# EAGLE board motherboard (EAGLE 9.1.2)
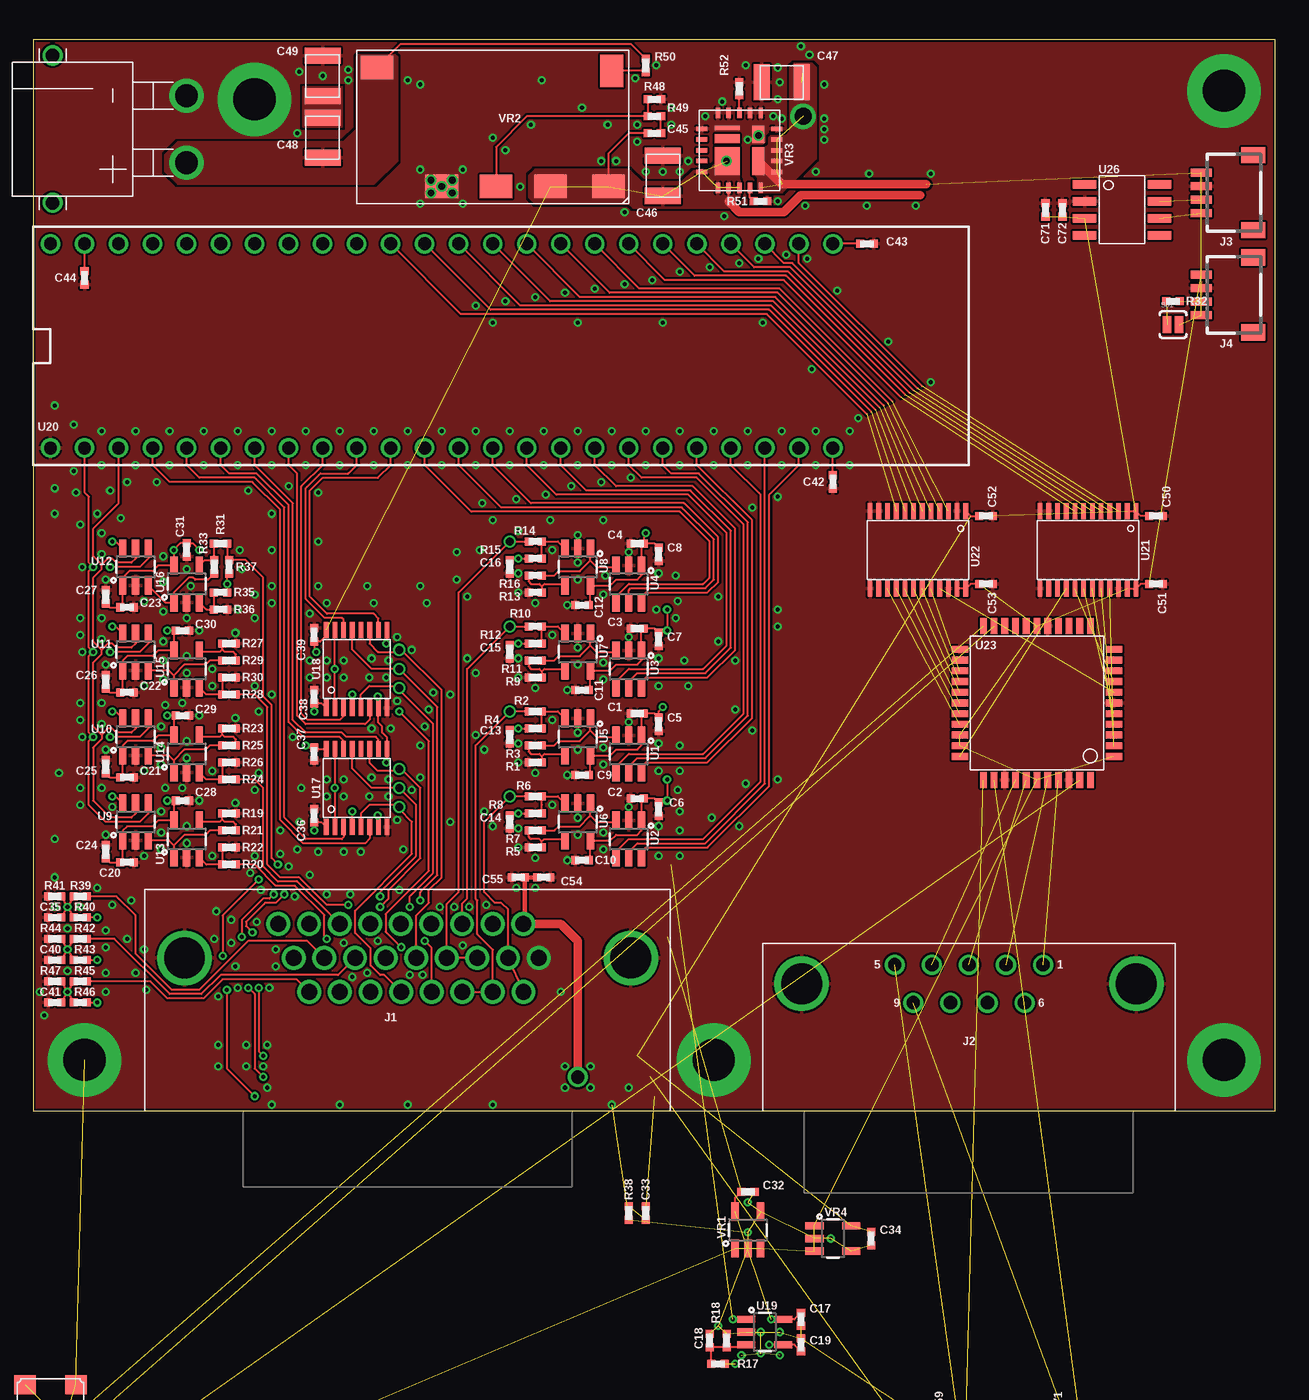
[diagram p5: board, top side]
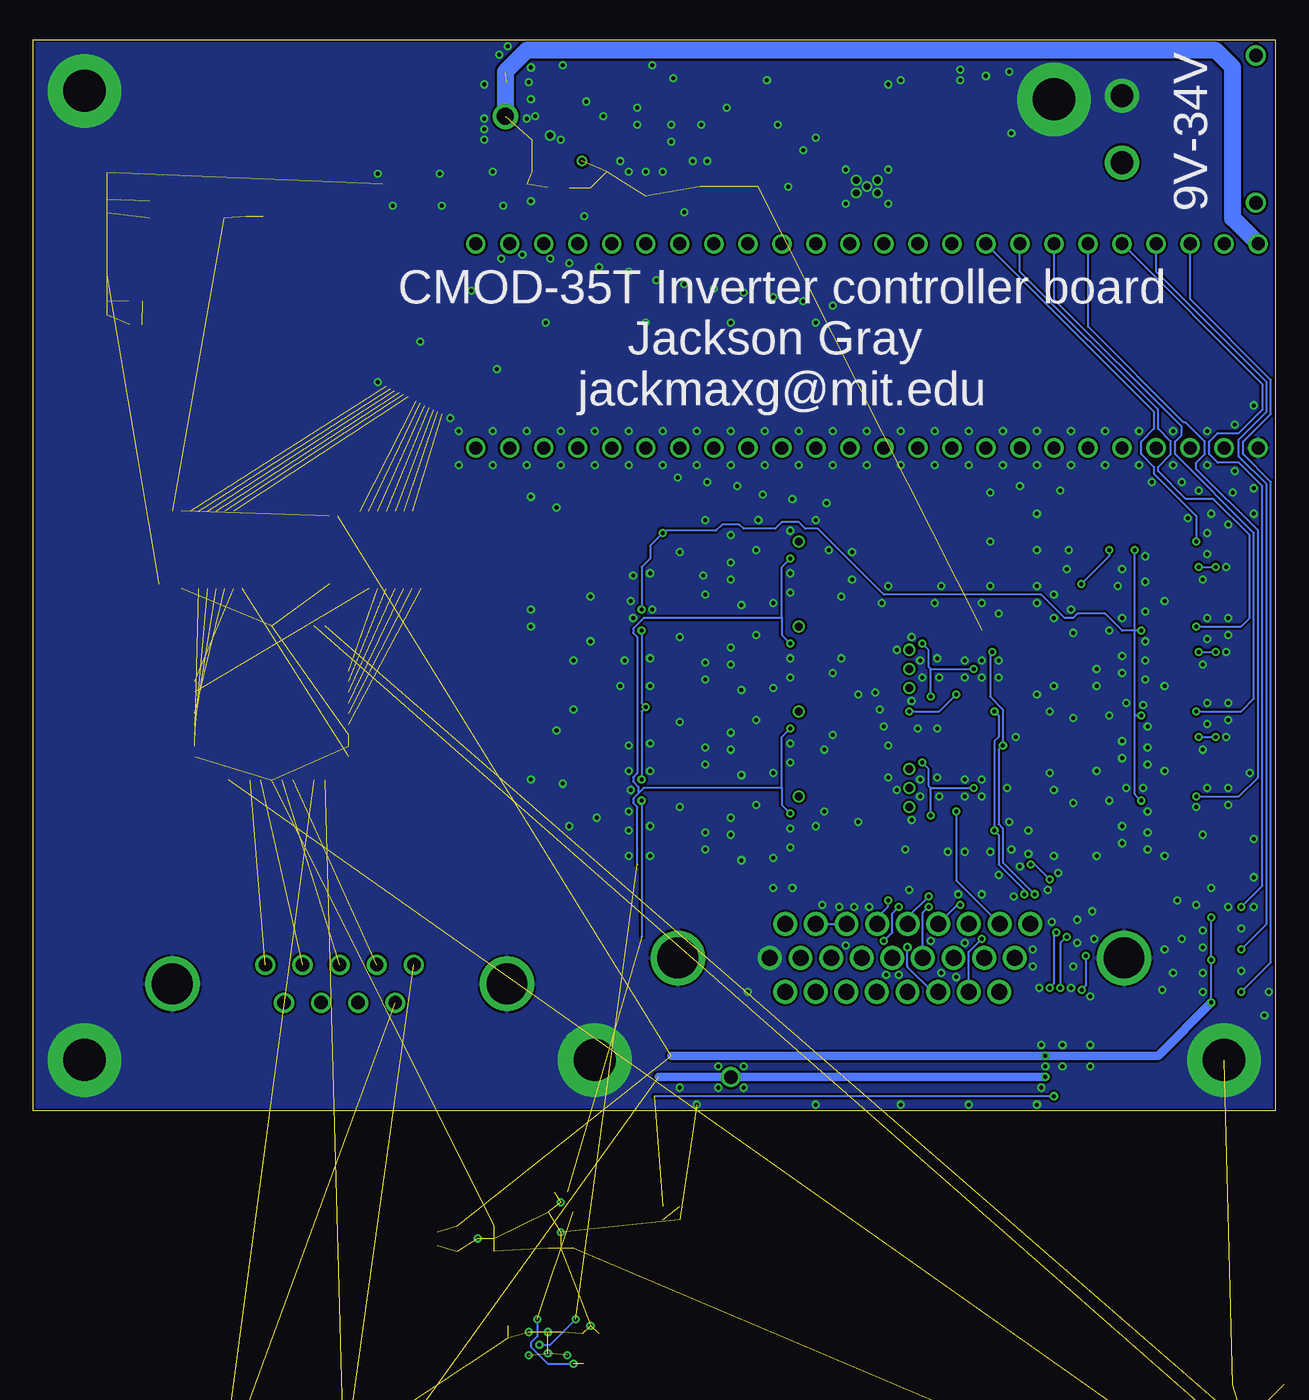
[diagram p6: board, bottom side, seen from below]

Size 92.71 x 80.01 mm. Coordinates in mm from the lower left corner, seen from the top.
Outline: 0,0 92.71,0 92.71,80.01 0,80.01 0,0
Copper layers (1*16): Top 0.035mm / dielectric 1.5mm / Bottom 0.035mm
Design rules "3PCB_2layer": minimum track width 6mil, minimum drill 0.3mm, track to track 6mil, track to pad 6mil, pad to pad 6mil, via to via 6mil, smd to smd 0mil, copper to edge 6mil, drill to drill 6mil, minimum pad ring 6mil, minimum via ring 6mil, stop-mask expansion 2mil, vias tented up to drill 0.3mm, thermal gap 6.25mil

## Footprints (pad centres in the part's own frame; a part is rotated, then mirrored left to right if it is on the bottom)
0402 = smd 0.6 x 0.6: 1 -0.5,0; 2 0.5,0
1210 = smd 1.2 x 2.7: 1 -1.5,0; 2 1.5,0
0603 = smd 1.1 x 1: 1 -0.85,0; 2 0.85,0
M3_HOLE = drill 3.15 pad 5.5: P 0,0
L17HTHA = drill 1.19: 1 8.63,13.97; 2 6.345,13.97; 3 4.06,13.97; 4 1.775,13.97; 5 -0.51,13.97; 6 -2.795,13.97; 7 -5.08,13.97; 8 -7.365,13.97; 9 -9.65,13.97; 10 9.78,11.43; 11 7.495,11.43; 12 5.21,11.43; 13 2.925,11.43; 14 0.64,11.43; 15 -1.645,11.43; 16 -3.93,11.43; 17 -6.215,11.43; 18 -8.5,11.43; 19 8.65,8.89; 20 6.365,8.89; 21 4.08,8.89; 22 1.795,8.89; 23 -0.49,8.89; 24 -2.775,8.89; 25 -5.06,8.89; 26 -7.345,8.89 | drill 3.05: ML -16.66,11.43; MR 16.66,11.43
AE10921 = drill 1: 1 5.54,10.92; 2 2.77,10.92; 3 0,10.92; 4 -2.77,10.92; 5 -5.54,10.92; 6 4.155,8.08; 7 1.385,8.08; 8 -1.385,8.08; 9 -4.155,8.08 | drill 3.05: ML -12.495,9.5; MR 12.495,9.5
SM04B-SRSS-TB = smd 0.6 x 1.55: 1 -1.5,2.975; 2 -0.5,2.975; 3 0.5,2.975; 4 1.5,2.975 | smd 1.2 x 1.8: FIT@1 -2.8,-0.9; FIT@2 2.8,-0.9
SOT23-3 = smd 0.8 x 0.9: 1 -0.95,-1; 2 0.95,-1; 3 0,1.1
0805 = smd 0.927 x 1.2: 1 -0.964,0; 2 0.964,0
SJ_2S-NO = smd 0.635 x 1.27: 1 -0.45,0; 2 0.45,0
1X01_50MIL = drill 0.6: 1 0,0
SOT23-6 = smd 0.55 x 1.35: 1 -0.95,-1.375; 2 0,-1.375; 3 0.95,-1.375; 4 0.95,1.375; 5 0,1.375; 6 -0.95,1.375
SOT23-5 = smd 0.55 x 1.35: 1 -0.95,-1.375; 2 0,-1.375; 3 0.95,-1.375; 4 0.95,1.375; 5 -0.95,1.375
TSSOP-16 = smd 1.2 x 0.35: 1 -2.9,2.275; 2 -2.9,1.625; 3 -2.9,0.975; 4 -2.9,0.325; 5 -2.9,-0.325; 6 -2.9,-0.975; 7 -2.9,-1.625; 8 -2.9,-2.275; 9 2.9,-2.275; 10 2.9,-1.625; 11 2.9,-0.975; 12 2.9,-0.325; 13 2.9,0.325; 14 2.9,0.975; 15 2.9,1.625; 16 2.9,2.275
CMOD_A7_DIP = drill 0.965: 1 -7.62,27.94; 2 -7.62,25.4; 3 -7.62,22.86; 4 -7.62,20.32; 5 -7.62,17.78; 6 -7.62,15.24; 7 -7.62,12.7; 8 -7.62,10.16; 9 -7.62,7.62; 10 -7.62,5.08; 11 -7.62,2.54; 12 -7.62,0; 13 -7.62,-2.54; 14 -7.62,-5.08; 15 -7.62,-7.62; 16 -7.62,-10.16; 17 -7.62,-12.7; 18 -7.62,-15.24; 19 -7.62,-17.78; 20 -7.62,-20.32; 21 -7.62,-22.86; 22 -7.62,-25.4; 23 -7.62,-27.94; 24/VU -7.62,-30.48; 25/GND 7.62,-30.48; 26 7.62,-27.94; 27 7.62,-25.4; 28 7.62,-22.86; 29 7.62,-20.32; 30 7.62,-17.78; 31 7.62,-15.24; 32 7.62,-12.7; 33 7.62,-10.16; 34 7.62,-7.62; 35 7.62,-5.08; 36 7.62,-2.54; 37 7.62,0; 38 7.62,2.54; 39 7.62,5.08; 40 7.62,7.62; 41 7.62,10.16; 42 7.62,12.7; 43 7.62,15.24; 44 7.62,17.78; 45 7.62,20.32; 46 7.62,22.86; 47 7.62,25.4; 48 7.62,27.94
TSSOP-24 = smd 1.2 x 0.35: 1 -2.9,3.575; 2 -2.9,2.925; 3 -2.9,2.275; 4 -2.9,1.625; 5 -2.9,0.975; 6 -2.9,0.325; 7 -2.9,-0.325; 8 -2.9,-0.975; 9 -2.9,-1.625; 10 -2.9,-2.275; 11 -2.9,-2.925; 12 -2.9,-3.575; 13 2.9,-3.575; 14 2.9,-2.925; 15 2.9,-2.275; 16 2.9,-1.625; 17 2.9,-0.975; 18 2.9,-0.325; 19 2.9,0.325; 20 2.9,0.975; 21 2.9,1.625; 22 2.9,2.275; 23 2.9,2.925; 24 2.9,3.575
LQFP44 = smd 1.2 x 0.5: 1 -5.75,4; 2 -5.75,3.2; 3 -5.75,2.4; 4 -5.75,1.6; 5 -5.75,0.8; 6 -5.75,0; 7 -5.75,-0.8; 8 -5.75,-1.6; 9 -5.75,-2.4; 10 -5.75,-3.2; 11 -5.75,-4; 23 5.75,-4; 24 5.75,-3.2; 25 5.75,-2.4; 26 5.75,-1.6; 27 5.75,-0.8; 28 5.75,0; 29 5.75,0.8; 30 5.75,1.6; 31 5.75,2.4; 32 5.75,3.2; 33 5.75,4 | smd 0.5 x 1.2: 12 -4,-5.75; 13 -3.2,-5.75; 14 -2.4,-5.75; 15 -1.6,-5.75; 16 -0.8,-5.75; 17 0,-5.75; 18 0.8,-5.75; 19 1.6,-5.75; 20 2.4,-5.75; 21 3.2,-5.75; 22 4,-5.75; 34 4,5.75; 35 3.2,5.75; 36 2.4,5.75; 37 1.6,5.75; 38 0.8,5.75; 39 0,5.75; 40 -0.8,5.75; 41 -1.6,5.75; 42 -2.4,5.75; 43 -3.2,5.75; 44 -4,5.75
SOIC_8 = smd 1.75 x 0.65: 1 -2.8,1.905; 2 -2.8,0.635; 3 -2.8,-0.635; 4 -2.8,-1.905; 5 2.8,-1.905; 6 2.8,-0.635; 7 2.8,0.635; 8 2.8,1.905
XT30_HORIZONTAL = drill 1.7: + -2.5,0; - 2.5,0 | drill 1: P$3 5.5,10; P$4 -5.5,10
PROLYNX = smd 1.727 x 2.438: 1 1.27,1.524 | smd 2.438 x 1.727: 2 18.796,1.27; 3 13.97,10.16; 4 9.906,10.16; 5 5.842,10.16; 6 1.524,10.16
UPOL_PWR_MODULE = smd 0.8 x 0.33: 1 -2.8,1.6; 2 -2.8,0.8; 3 -2.8,0; 4 -2.8,-0.8; 5 -2.8,-1.6; 11 2.8,-1.6; 12 2.8,-0.8; 13 2.8,0; 14 2.8,0.8; 15 2.8,1.6 | smd 0.33 x 0.8: 6 -1.6,-2.8; 7 -0.8,-2.8; 8 0,-2.8; 9 0.8,-2.8; 10 1.6,-2.8; 16 1.6,2.8; 17 0.8,2.8; 18 0,2.8; 19 -0.8,2.8; 20 -1.6,2.8 | smd 2.1 x 1.88: 21 -0.8,0.91 | smd 0.65 x 1.88: 22 0.865,0.91 | smd 0.36 x 1.88: 23 1.67,0.91 | smd 2.1 x 0.9: 24 -0.8,-1.4 | smd 1.3 x 0.9: 25 1.2,-1.4
5X3.2MM_SMD_XTAL = smd 1.6 x 1.4: 1 -1.9,1.15; 2 1.9,1.15; 3 1.9,-1.15; 4 -1.9,-1.15

## Placement (x,y rotation side)
C1  10n  [0402]  45.09,29.69 180 top
C2  10n  [0402]  45.09,23.34 180 top
C3  10n  [0402]  45.09,36.04 180 top
C4  10n  [0402]  45.09,42.39 180 top
C5  1u  [0402]  46.67,28.89 270 top
C6  1u  [0402]  46.67,22.54 270 top
C7  1u  [0402]  46.67,35.24 270 top
C8  1u  [0402]  46.67,41.59 270 top
C9  10n  [0402]  40.96,25.08 180 top
C10  10n  [0402]  40.96,18.73 180 top
C11  10n  [0402]  40.96,31.43 180 top
C12  10n  [0402]  40.96,37.78 180 top
C13  10n  [0402]  35.56,27.94 270 top
C14  10n  [0402]  35.56,21.59 270 top
C15  10n  [0402]  35.56,34.29 270 top
C16  10n  [0402]  35.56,40.64 270 top
C17  10n  [0402]  57.31,-15.56 270 top  (outside the outline)
C18  10n  [0402]  50.48,-17.14 90 top  (outside the outline)
C19  1u  [0402]  57.31,-17.46 90 top  (outside the outline)
C20  10n  [0402]  6.99,18.57 0 top
C21  10n  [0402]  6.99,24.92 0 top
C22  10n  [0402]  6.99,31.27 0 top
C23  10n  [0402]  6.99,37.62 0 top
C24  1u  [0402]  5.4,19.37 90 top
C25  1u  [0402]  5.4,25.72 90 top
C26  1u  [0402]  5.4,32.07 90 top
C27  1u  [0402]  5.4,38.42 90 top
C28  10n  [0402]  11.11,23.18 0 top
C29  10n  [0402]  11.11,29.53 0 top
C30  10n  [0402]  11.11,35.88 0 top
C31  10n  [0402]  11.43,41.91 270 top
C32  1u  [0402]  53.34,-6.03 0 top  (outside the outline)
C33  10n  [0402]  45.72,-7.62 270 top  (outside the outline)
C34  1u  [0402]  62.55,-9.53 270 top  (outside the outline)
C35  1u  [0402]  1.59,14.45 180 top
C36  1u  [0402]  20.95,22.07 90 top
C37  1u  [0402]  20.95,26.67 270 top
C38  1u  [0402]  20.95,30.96 90 top
C39  1u  [0402]  20.95,35.56 90 top
C40  1u  [0402]  1.59,11.27 180 top
C41  1u  [0402]  1.59,8.1 180 top
C42  1u  [0402]  59.69,46.99 270 top
C43  1u  [0402]  62.23,64.77 0 top
C44  1u  [0402]  3.81,62.23 270 top
C45  220p  [0402]  46.35,73.03 0 top
C46  22u  [1210]  46.99,69.85 90 top
C47  22u  [1210]  55.88,76.83 180 top
C48  22u  [1210]  21.59,72.71 90 top
C49  22u  [1210]  21.59,77.31 90 top
C50  1u  [0402]  83.82,44.45 0 top
C51  1u  [0402]  83.82,39.37 180 top
C52  1u  [0402]  71.12,44.45 0 top
C53  1u  [0402]  71.12,39.37 180 top
C54  1u  [0402]  38.1,17.46 0 top
C55  1u  [0402]  36.2,17.46 180 top
C56  20p  [0402]  2.54,-24.13 0 top  (outside the outline)
C57  20p  [0402]  2.54,-26.67 0 top  (outside the outline)
C58  10u  [0603]  2.54,-29.21 0 top  (outside the outline)
C59  10u  [0603]  2.54,-31.75 0 top  (outside the outline)
C60  10u  [0603]  2.54,-34.29 0 top  (outside the outline)
C61  10u  [0603]  2.54,-36.83 0 top  (outside the outline)
C62  10n  [0402]  2.54,-39.37 0 top  (outside the outline)
C63  10n  [0402]  2.54,-41.91 0 top  (outside the outline)
C64  10n  [0402]  2.54,-44.45 0 top  (outside the outline)
C65  1u  [0402]  70.48,-37.47 270 top  (outside the outline)
C66  1u  [0402]  65.09,-23.5 90 top  (outside the outline)
C67  1u  [0402]  73.98,-23.5 90 top  (outside the outline)
C68  DNP  [0402]  69.06,-26.67 0 top  (outside the outline)
C69  DNP  [0402]  77.95,-26.67 0 top  (outside the outline)
C70  1u  [0402]  79.38,-37.47 270 top  (outside the outline)
C71  1u  [0402]  75.56,67.31 90 top
C72  10n  [0402]  76.83,67.31 90 top
H1  BOLTHOLE_M3  [M3_HOLE]  50.8,3.81 0 top
H2  BOLTHOLE_M3  [M3_HOLE]  16.51,75.56 0 top
H3  BOLTHOLE_M3  [M3_HOLE]  88.9,76.2 0 top
H4  BOLTHOLE_M3  [M3_HOLE]  3.81,3.81 0 top
H5  BOLTHOLE_M3  [M3_HOLE]  88.9,3.81 0 top
J1  PRIUS_INV_DB26  [L17HTHA]  27.94,0 0 top
J2  DB09_RA  [AE10921]  69.85,0 0 top
J3  [SM04B-SRSS-TB]  90.17,68.58 90 top
J4  [SM04B-SRSS-TB]  90.17,60.96 90 top
Q1  [SOT23-3]  69.22,-35.56 270 top  (outside the outline)
Q2  [SOT23-3]  69.22,-30.48 270 top  (outside the outline)
Q3  [SOT23-3]  65.41,-35.56 90 top  (outside the outline)
Q4  [SOT23-3]  65.41,-30.48 90 top  (outside the outline)
Q5  [SOT23-3]  78.11,-35.56 270 top  (outside the outline)
Q6  [SOT23-3]  78.11,-30.48 270 top  (outside the outline)
Q7  [SOT23-3]  74.3,-35.56 90 top  (outside the outline)
Q8  [SOT23-3]  74.3,-30.48 90 top  (outside the outline)
R1  100k  [0402]  37.47,26.04 0 top
R2  100k  [0402]  37.47,29.84 0 top
R3  13.7k  [0402]  37.47,27.3 0 top
R4  13.7k  [0402]  37.47,28.57 180 top
R5  100k  [0402]  37.47,19.68 0 top
R6  100k  [0402]  37.47,23.5 0 top
R7  13.7k  [0402]  37.47,20.95 0 top
R8  13.7k  [0402]  37.47,22.23 180 top
R9  100k  [0402]  37.47,32.38 0 top
R10  100k  [0402]  37.47,36.2 0 top
R11  13.7k  [0402]  37.47,33.66 0 top
R12  13.7k  [0402]  37.47,34.92 180 top
R13  100k  [0402]  37.47,38.73 0 top
R14  100k  [0402]  37.47,42.55 0 top
R15  13.7k  [0402]  37.47,41.27 180 top
R16  13.7k  [0402]  37.47,40.01 0 top
R17  1k  [0402]  51.12,-18.89 180 top  (outside the outline)
R18  1k  [0402]  51.75,-17.14 90 top  (outside the outline)
R19  DNP  [0402]  14.61,22.23 180 top
R20  100k  [0402]  14.61,18.41 180 top
R21  0  [0402]  14.61,20.95 180 top
R22  37.4k  [0402]  14.61,19.68 0 top
R23  DNP  [0402]  14.61,28.57 180 top
R24  100k  [0402]  14.61,24.77 180 top
R25  0  [0402]  14.61,27.3 180 top
R26  37.4k  [0402]  14.61,26.04 0 top
R27  DNP  [0402]  14.61,34.92 180 top
R28  100k  [0402]  14.61,31.11 180 top
R29  0  [0402]  14.61,33.66 180 top
R30  37.4k  [0402]  14.61,32.38 0 top
R31  [0402]  13.97,42.39 0 top
R32  120  [0402]  85.09,60.48 180 top
R33  [0402]  13.49,40.64 270 top
R35  [0402]  13.97,38.73 180 top
R36  10k  [0402]  13.97,37.47 0 top
R37  [0402]  14.61,40.64 90 top
R38  0  [0402]  44.45,-7.62 270 top  (outside the outline)
R39  0  [0402]  3.49,16.03 180 top
R40  1k  [0402]  3.49,14.45 180 top
R41  DNP  [0402]  1.59,16.03 180 top
R42  0  [0402]  3.49,12.86 180 top
R43  1k  [0402]  3.49,11.27 180 top
R44  DNP  [0402]  1.59,12.86 180 top
R45  0  [0402]  3.49,9.68 180 top
R46  1k  [0402]  3.49,8.1 180 top
R47  DNP  [0402]  1.59,9.68 180 top
R48  6.19k  [0402]  46.35,75.56 0 top
R49  330  [0402]  46.35,74.3 180 top
R50  100k  [0402]  45.72,78.11 270 top
R51  13.7k  [0402]  54.29,67.94 0 top
R52  100  [0402]  52.7,76.36 90 top
R53  1k  [0402]  69.06,-25.4 180 top  (outside the outline)
R54  2.4k  [0402]  69.06,-27.94 180 top  (outside the outline)
R55  2.2k  [0402]  70.33,-33.02 90 top  (outside the outline)
R56  3.3  [0402]  68.1,-33.02 90 top  (outside the outline)
R57  3.3  [0402]  66.52,-33.02 270 top  (outside the outline)
R58  2.2k  [0402]  64.29,-33.02 270 top  (outside the outline)
R59  10k  [0402]  67.63,-23.5 270 top  (outside the outline)
R60  4.16k  [0402]  66.36,-23.5 90 top  (outside the outline)
R61  1k  [0402]  77.95,-25.4 180 top  (outside the outline)
R62  2.4k  [0402]  77.95,-27.94 180 top  (outside the outline)
R63  2.2k  [0402]  79.22,-33.02 270 top  (outside the outline)
R64  3.3  [0402]  76.99,-33.02 270 top  (outside the outline)
R65  3.3  [0402]  75.41,-33.02 90 top  (outside the outline)
R66  2.2k  [0402]  73.18,-33.02 90 top  (outside the outline)
R67  4.7k  [0805]  68.42,-38.42 180 top  (outside the outline)
R68  4.7  [0805]  65.09,-38.42 180 top  (outside the outline)
R69  4.7  [0805]  77.31,-38.42 180 top  (outside the outline)
R70  4.7  [0805]  74.14,-38.42 180 top  (outside the outline)
R71  10k  [0402]  76.52,-23.5 270 top  (outside the outline)
R72  4.16k  [0402]  75.25,-23.5 90 top  (outside the outline)
SJ1  [SJ_2S-NO]  85.09,58.74 0 top
TP1  MIV  [1X01_50MIL]  35.56,29.84 0 top
TP2  MIW  [1X01_50MIL]  35.56,23.5 0 top
TP3  GIV  [1X01_50MIL]  35.56,36.2 180 top
TP4  GIW  [1X01_50MIL]  35.56,42.55 180 top
TP5  !MUU  [1X01_50MIL]  27.3,22.7 90 top
TP6  !MVU  [1X01_50MIL]  27.3,25.56 90 top
TP7  !MWU  [1X01_50MIL]  27.3,24.13 90 top
TP8  !GUU  [1X01_50MIL]  27.3,31.59 90 top
TP9  !GVU  [1X01_50MIL]  27.3,34.45 90 top
TP10  !GWU  [1X01_50MIL]  27.3,33.02 90 top
TP11  !EXCOUT  [1X01_50MIL]  79.38,-28.57 180 top  (outside the outline)
TP12  EXCOUT  [1X01_50MIL]  70.48,-28.57 180 top  (outside the outline)
U1  ADS7883  [SOT23-6]  44.45,26.67 180 top
U2  ADS7883  [SOT23-6]  44.45,20.32 180 top
U3  ADS7883  [SOT23-6]  44.45,33.02 180 top
U4  ADS7883  [SOT23-6]  44.45,39.37 180 top
U5  LM7321  [SOT23-5]  40.64,27.94 180 top
U6  LM7321  [SOT23-5]  40.64,21.59 180 top
U7  LM7321  [SOT23-5]  40.64,34.29 180 top
U8  LM7321  [SOT23-5]  40.64,40.64 180 top
U9  ADS7883  [SOT23-6]  7.62,21.59 0 top
U10  ADS7883  [SOT23-6]  7.62,27.94 0 top
U11  ADS7883  [SOT23-6]  7.62,34.29 0 top
U12  ADS7883  [SOT23-6]  7.62,40.64 0 top
U13  LM7321  [SOT23-5]  11.43,20.32 0 top
U14  LM7321  [SOT23-5]  11.43,26.67 0 top
U15  LM7321  [SOT23-5]  11.43,33.02 0 top
U16  LM7321  [SOT23-5]  11.43,39.37 0 top
U17  CD40109BPWR  [TSSOP-16]  24.13,24.13 90 top
U18  CD40109BPWR  [TSSOP-16]  24.13,33.02 90 top
U19  LM7321  [SOT23-5]  54.61,-16.51 270 top  (outside the outline)
U20  CMOD_A7  [CMOD_A7_DIP]  31.75,57.15 270 top
U21  [TSSOP-24]  78.74,41.91 270 top
U22  [TSSOP-24]  66.04,41.91 270 top
U23  ADS1205  [LQFP44]  74.93,30.48 180 top
U24  LM7321  [SOT23-5]  66.04,-26.67 0 top  (outside the outline)
U25  LM7321  [SOT23-5]  74.93,-26.67 0 top  (outside the outline)
U26  SN65HVD23X  [SOIC_8]  81.28,67.31 0 top
U$1  XT30  [XT30_HORIZONTAL]  11.43,73.34 90 top
VR1  [SOT23-5]  53.34,-8.89 0 top  (outside the outline)
VR2  PROLYNX  [PROLYNX]  44.45,79.22 180 top
VR3  MUN24AD03-SM  [UPOL_PWR_MODULE]  52.7,71.75 90 top
VR4  [SOT23-5]  59.69,-9.53 270 top  (outside the outline)
Y1  8.192mHz  [5X3.2MM_SMD_XTAL]  1.27,-21.59 0 top  (outside the outline)

## Tracks (layer width: path | path; a pad name or v marks a point on that pad's centre or on a via)
3.3V  (via drill 0.3)  (7 unrouted)
  Top 0.159: R46.1 v4.76,8.1 | v4.76,14.45 R40.1 | R43.1 v4.76,11.27 | U21.2 U21.1 82.67,44.45 C50.1 | U22.1 69.97,44.45 C52.1 | v20.95,29.84 C38.1 21.52,30.46 U18.1 | v20.95,20.95 C36.1 21.52,21.57 U17.1 | v18.73,16.19 18.1,15.56 17.3,15.56 15.88,14.13 15.88,13.81 v16.35,13.34 | v16.83,9.21 16.83,4.45 v17.14,4.13
  Bottom 0.159: v4.76,8.1 v4.76,11.27 v4.76,14.45 | v20.95,29.84 20.64,29.53 20.64,27.94 20.95,27.62 v20.95,20.95 20.64,20.64 20.64,18.41 18.73,16.51 v18.73,16.19 | v16.83,9.21 16.51,9.53 16.51,13.18 v16.35,13.34
  Bottom 0.635: v4.76,8.1 8.73,4.13 v17.14,4.13 45.09,4.13
5V  (via drill 1.27)  (26 unrouted)
  Top 0.159: C51.2 82.67,39.37 U21.24 U21.23 | C53.2 69.97,39.37 U22.24 U22.23
  Top 0.635: 66.67,69.22 55.88,69.22 VR3.24
  Bottom 1.27: U20.24/VU 3.17,66.67 3.17,77.95 4.45,79.22 55.88,79.22 57.47,77.63 v57.47,74.3
  pour Top (no thermals): 53.82,71.91 54.61,71.91 54.93,72.23 54.93,72.71 55.09,72.87 56.2,72.87 56.52,73.18 56.52,77.95 56.83,78.26 58.1,78.26 58.42,77.95 58.42,71.12 55.88,68.58 54.29,68.58 54.13,68.74 54.13,69.69 53.82,70.01
12V  (via drill 0.3, 0.5, 1)  (21 unrouted)
  Top 0.159: U17.16 21.09,27.03 C37.1 20.45,27.17 v20.32,27.3 | C45.1 44.45,73.03 42.93,71.5 VR2.6 | 51.91,67.94 51.91,67.95 VR3.2 | v21.11,34.29 20.95,34.45 C39.1 21.41,35.06 21.86,35.51 U18.16 | v15.56,13.02 15.56,14.29 17.14,15.88 17.62,15.88 v17.94,16.19 | v16.03,9.21 16.51,8.73 16.51,3.17 v17.14,2.54
  Top 0.318: C54.1 C55.1 36.7,14.1 J1.1
  Top 0.635: 66.2,68.42 57.31,68.42 56.04,67.15 52.7,67.15 51.91,67.94 | J1.1 39.37,13.97 40.64,12.7 v40.64,2.54
  Bottom 0.159: v21.11,34.29 21.27,34.13 21.27,30.96 20.32,30 v20.32,27.3 20.64,26.99 20.64,21.43 20.32,21.11 20.32,18.57 v17.94,16.19 | v15.56,13.02 16.03,12.54 v16.03,9.21
  Bottom 0.635: 46.04,2.54 v40.64,2.54 v17.14,2.54
  other vias: 51.75,70.96
  pour Top: 46.99,69.37 45.4,69.37 44.45,70.33 37.47,70.33 36.99,69.85 36.99,68.9 36.99,68.26 37.47,67.79 44.45,67.79 44.77,67.47 47.94,67.47 51.91,67.47 52.86,68.42 52.86,69.37 52.7,69.53 52.7,71.6 52.39,71.91 51.12,71.91 50.96,71.75 50.96,70.8 50.48,70.33 49.37,70.33 48.42,69.37
!ADC_GIV_CS
  Top 0.159: U3.6 45.4,32.06 45.72,32.38 50.32,32.38 52.39,34.45 52.39,43.5 49.21,46.67 43.5,46.67 41.91,48.26 U20.41
!ADC_GIVT_CS  (via drill 0.3)
  Top 0.159: U11.6 6.14,36.2 v5.87,36.2
  Bottom 0.159: v5.87,36.2 2.54,36.2 1.91,36.83 1.91,43.02 4.6,45.72 6.67,45.72 8.73,47.78 8.73,48.1 7.78,49.05 7.78,50.01 8.73,50.96 8.73,52.39 19.05,62.71 U20.17
!ADC_GIW_CS
  Top 0.159: U4.6 45.4,38.41 45.72,38.73 50.32,38.73 51.12,39.53 51.12,42.86 48.58,45.4 37.15,45.4 34.29,48.26 U20.38
!ADC_MIV_CS
  Top 0.159: U1.6 45.4,25.71 45.72,26.04 50.32,26.04 53.66,29.37 53.66,44.13 49.53,48.26 U20.44
!ADC_MIVT_CS  (via drill 0.3)
  Top 0.159: U10.6 6.14,29.84 v5.87,29.84
  Bottom 0.159: v5.87,29.84 2.54,29.84 1.59,30.8 1.59,43.18 7.46,49.05 7.46,50.01 6.99,50.48 6.99,51.12 16.51,60.64 U20.18
!ADC_MIW_CS
  Top 0.159: U2.6 45.4,19.36 45.72,19.68 50.32,19.68 54.93,24.29 54.93,46.04 57.15,48.26 U20.47
!ADC_MTEMP_CS  (via drill 0.3)
  Top 0.159: U12.6 6.14,42.55 v5.87,42.55
  Bottom 0.159: v5.87,42.55 5.87,44.45 9.05,47.62 9.05,48.1 10,49.05 10,50.01 9.05,50.96 9.05,52.23 U20.16
!ADC_VH_CS  (via drill 0.3)
  Top 0.159: U9.6 6.14,23.5 v5.87,23.5
  Bottom 0.159: v5.87,23.5 2.7,23.5 1.27,24.92 1.27,43.34 5.87,47.94 5.87,48.42 5.24,49.05 5.24,50.01 6.67,51.44 6.83,51.44 13.97,58.58 U20.19
!GSDN  (via drill 0.3)
  Top 0.159: v27.45,12.24 26.3,13.39 26.3,14.71 29.53,17.94 29.53,27.62 v27.3,29.84 | v23.81,31.11 v23.8,31.11 U18.4
  Bottom 0.159: J1.24 25.56,8.89 27.45,10.78 v27.45,12.24 | v27.3,29.84 25.08,29.84 v23.81,31.11
!GSDN_LV
  Top 0.159: U18.3 23.16,29.5 22.86,29.21 20.48,29.21 20,29.69 20,46.67 21.59,48.26 U20.33
!GUU  (via drill 0.3)
  Top 0.159: J1.22 29.73,12.18 v29.21,12.7 | v28.1,15.24 28.1,16.03 29.84,17.78 29.84,28.89 27.3,31.43 TP8.1 27.15,31.75 25.08,31.75 24.45,31.12 U18.5
  Bottom 0.159: v29.21,12.7 28.57,13.34 28.57,14.76 v28.1,15.24
!GUU_LV
  Top 0.159: U18.6 25.11,29.23 24.77,28.89 20.32,28.89 19.68,29.53 19.68,47.62 19.05,48.26 U20.32
!GVU
  Top 0.159: J1.14 28.58,14.6 29.53,15.55 29.53,16.51 30.48,17.46 30.48,31.43 27.46,34.45 TP9.1 27.15,34.29 25.72,34.29 25.11,34.9 U18.11
!GVU_LV
  Top 0.159: U18.10 25.75,36.79 25.4,37.15 21.91,37.15 20.64,38.42 20.64,46.35 21.59,47.31 25.72,47.31 26.67,48.26 U20.35
!GWU  (via drill 0.3)
  Top 0.159: v28.89,15.72 28.89,16.35 30.16,17.62 30.16,30.16 TP10.1 25.24,33.02 23.8,34.46 U18.13
  Bottom 0.159: v28.89,15.72 28.89,15.27 29.71,14.45 J1.4
!GWU_LV
  Top 0.159: U18.14 23.16,36.69 23.02,36.83 21.75,36.83 20.32,38.26 20.32,46.51 21.43,47.62 23.5,47.62 24.13,48.26 U20.34
!MSDN  (via drill 0.3)
  Top 0.159: U17.4 v23.8,22.38 v23.81,22.38
  Bottom 0.159: v23.81,22.38 23.81,17.21 J1.8
!MSDN_LV
  Top 0.159: U17.3 23.16,20.46 23.02,20.32 20.32,20.32 18.73,21.91 18.73,45.09 16.51,47.31 12.38,47.31 11.43,48.26 U20.29
!MUU
  Top 0.159: J1.23 26.18,10.16 25.88,10.16 25.16,10.87 25.16,12.14 24.01,13.3 24.01,14.96 28.26,19.21 28.26,21.59 27.3,22.54 TP5.1 27.15,22.86 25.08,22.86 24.45,22.23 U17.5
!MUU_LV
  Top 0.159: U17.6 25.11,20.34 24.77,20 20.16,20 18.41,21.75 18.41,44.93 16.35,46.99 10.16,46.99 8.89,48.26 U20.28
!MVU  (via drill 0.3)
  Top 0.159: v25.88,15.24 26.51,15.88 26.51,16.51 28.89,18.89 28.89,24.13 27.46,25.56 TP6.1 27.15,25.4 25.72,25.4 25.11,26.01 U17.11
  Bottom 0.159: J1.15 26.3,14.82 v25.88,15.24
!MVU_LV
  Top 0.159: U17.10 25.75,27.74 25.56,27.94 23.34,27.94 23.02,28.26 20.32,28.26 19.37,29.21 19.37,45.4 16.51,48.26 U20.31
!MWU  (via drill 0.3)
  Top 0.159: v25.88,16.03 25.88,16.35 28.57,19.05 28.57,22.86 TP7.1 25.24,24.13 23.8,25.57 U17.13
  Bottom 0.159: J1.5 27.43,14.48 v25.88,16.03
!MWU_LV
  Top 0.159: U17.14 23.16,27.64 22.86,27.94 20.16,27.94 19.05,29.05 19.05,45.24 16.67,47.62 14.61,47.62 13.97,48.26 U20.30
!RD_CS  (1 unrouted)
!RD_CS_LV  (1 unrouted)
  Top 0.159: 66.04,53.98 56.67,63.34 56.04,63.34 U20.3
!RD_DOS  (1 unrouted)
!RD_DOS_LV  (1 unrouted)
  Top 0.159: 62.55,52.23 54.93,59.85 34.13,59.85 U20.13
!RD_EXC  (1 unrouted)
!RD_EXCOUT  (5 unrouted)
!RD_LOT  (1 unrouted)
!RD_LOT_LV  (1 unrouted)
  Top 0.159: 62.23,52.07 54.77,59.53 31.91,59.53 U20.14
!RD_RD  (1 unrouted)
!RD_RD_LV  (1 unrouted)
  Top 0.159: 66.36,54.13 57.15,63.34 U20.2
!RD_RDVEL  (1 unrouted)
!RD_RDVEL_LV  (1 unrouted)
  Top 0.159: 65.41,53.66 56.36,62.71 51.59,62.71 U20.5
!RD_RESET  (1 unrouted)
!RD_RESET_LV  (1 unrouted)
  Top 0.159: 64.77,53.34 56.04,62.07 47.15,62.07 U20.7
!RD_SAMPLE  (1 unrouted)
!RD_SAMPLE_LV  (1 unrouted)
  Top 0.159: 65.72,53.82 56.52,63.02 53.82,63.02 U20.4
ADC_GIV_SCLK
  Top 0.159: U3.4 43.5,32.07 44.45,33.02 50.01,33.02 51.75,34.77 51.75,43.18 48.9,46.04 39.05,46.04 36.83,48.26 U20.39
ADC_GIV_SDO
  Top 0.159: U3.5 44.45,32.07 45.09,32.7 50.16,32.7 52.07,34.61 52.07,43.34 49.05,46.35 41.27,46.35 39.37,48.26 U20.40
ADC_GIW_SCLK
  Top 0.159: U4.4 43.5,38.42 44.45,39.37 50.01,39.37 50.48,39.85 50.48,41.91 50.48,42.55 48.26,44.77 32.7,44.77 29.21,48.26 U20.36
ADC_GIW_SDO
  Top 0.159: U4.5 44.45,38.89 44.61,39.05 50.16,39.05 50.8,39.69 50.8,42.7 48.42,45.09 34.92,45.09 31.75,48.26 U20.37
ADC_HALFV  (via drill 0.3)  (1 unrouted)
  Top 0.159: C14.1 35.7,22.23 v36.2,22.23 R8.2 | C13.1 35.7,28.57 v36.2,28.57 R4.2 | C15.1 35.7,34.92 v36.2,34.92 R12.2 | C16.1 35.7,41.27 v36.2,41.27 R15.2 | C19.1 56.81,-17.46 U19.4 v54.93,-17.46 | v52.23,-15.56 U19.1
  Bottom 0.159: 36.83,36.83 36.83,40.64 v36.2,41.27 | 36.83,36.83 36.83,35.56 v36.2,34.92 | 36.83,24.13 36.83,27.94 v36.2,28.57 | 36.83,24.13 36.83,22.86 v36.2,22.23 | 47.55,23.73 47.15,24.13 36.83,24.13 | 47.55,23.73 47.94,23.34 47.94,23.02 47.62,22.7 47.62,18.41 | 36.83,36.83 47.15,36.83 47.94,36.04 47.94,35.72 47.62,35.4 47.62,25.24 47.94,24.92 47.94,24.61 47.55,24.21 47.55,23.73 | v54.93,-17.46 54.13,-17.46 v52.23,-15.56
ADC_HALFV_REF
  Top 0.159: U19.3 53.05,-17.64 R18.1 C18.1 50.62,-17.78 R17.2
ADC_LFREQ_SCLK  (via drill 0.3)
  Top 0.159: U9.4 8.57,22.22 7.94,21.59 5.4,21.59 4.13,22.86 4.13,27.62 v4.45,27.94 4.13,28.26 4.13,33.97 v4.45,34.29 4.13,34.61 4.13,40.32 v4.45,40.64 4.13,40.96 4.13,45.88 3.81,46.2 U20.26 | U10.4 8.57,28.57 7.94,27.94 v5.71,27.94 | U11.4 8.57,34.92 7.94,34.29 v5.71,34.29 | U12.4 8.57,41.27 7.94,40.64 v5.71,40.64
  Bottom 0.159: v5.71,40.64 v4.45,40.64 | v5.71,34.29 v4.45,34.29 | v5.71,27.94 v4.45,27.94
ADC_LFREQ_SDO
  Top 0.159: U9.5 7.62,22.23 7.3,21.91 5.71,21.91 4.45,23.18 4.45,27.15 5.08,27.78 5.08,28.1 | U10.5 7.62,28.57 7.3,28.26 6.19,28.26 5.87,28.57 5.56,28.57 5.08,28.1 | U11.5 7.62,34.92 7.3,34.61 6.19,34.61 5.87,34.92 5.56,34.92 5.08,34.45 | U12.5 7.62,41.27 7.3,40.96 6.19,40.96 5.87,41.27 5.56,41.27 5.08,40.8 | 5.08,28.1 4.45,28.73 4.45,33.5 5.08,34.13 5.08,34.45 | 5.08,34.45 4.45,35.08 4.45,39.85 5.08,40.48 5.08,40.8 | 5.08,40.8 4.45,41.43 4.45,43.5 6.35,45.4 U20.27
ADC_MIV_SCLK
  Top 0.159: U1.4 43.5,25.72 44.45,26.67 50.01,26.67 53.02,29.69 53.02,43.81 49.53,47.31 45.4,47.31 44.45,48.26 U20.42
ADC_MIV_SDO
  Top 0.159: U1.5 44.45,25.72 45.09,26.35 50.16,26.35 53.34,29.53 53.34,43.97 49.69,47.62 47.62,47.62 46.99,48.26 U20.43
ADC_MIW_SCLK
  Top 0.159: U2.4 43.5,19.37 44.45,20.32 50.01,20.32 54.29,24.61 54.29,46.04 52.07,48.26 U20.45
ADC_MIW_SDO
  Top 0.159: U2.5 44.45,19.37 45.09,20 50.16,20 54.61,24.45 U20.46
ADC_VDD  (via drill 0.3)  (3 unrouted)
  Top 0.159: C4.1 45.4,42.2 U4.1 45.4,40 45.09,39.69 43.5,39.69 43.08,39.27 U8.5 41.59,37.91 C12.1 | C8.1 46.38,42.39 C4.1 | C10.1 41.59,18.86 U6.5 43.08,20.21 43.5,20.64 45.09,20.64 45.4,20.95 U2.1 45.4,23.15 C2.1 46.38,23.34 C6.1 46.81,23.18 v47.31,23.18 v47.31,24.77 | C9.1 41.59,25.21 U5.5 43.08,26.57 43.5,26.99 45.09,26.99 45.4,27.3 U1.1 45.4,29.5 C1.1 46.38,29.69 C5.1 46.67,29.84 v46.99,30.16 | C11.1 41.59,31.57 U7.5 43.08,32.91 43.5,33.34 45.09,33.34 45.4,33.65 U3.1 45.4,35.85 C3.1 46.38,36.04 C7.1 46.81,35.88 v47.31,35.88 v47.31,37.47 | C24.1 5.69,18.57 C20.1 6.67,18.76 U9.1 6.67,20.95 6.99,21.27 8.89,21.27 9.31,21.7 U13.5 10.48,23.05 C28.1 v10,23.18 | C25.1 5.69,24.92 C21.1 6.67,25.11 U10.1 6.67,27.3 6.99,27.62 8.89,27.62 9.31,28.05 U14.5 10.48,29.39 C29.1 v10,29.53 | C26.1 5.69,31.27 C22.1 6.67,31.46 U11.1 6.67,33.66 6.99,33.97 8.89,33.97 9.31,34.4 U15.5 10.48,35.74 C30.1 v10,35.88 | C27.1 5.69,37.62 C23.1 6.67,37.81 U12.1 6.83,39.42 6.83,40.01 7.14,40.32 8.89,40.32 9.31,40.74 U16.5 v10.48,41.91 10.98,42.41 C31.1 11.88,42.41 v12.38,41.91 | R35.1 v14.47,39.37 14.47,40.01 R37.1 | v45.72,43.18 45.59,43.05 C4.1 | VR1.5 52.39,-6.48 C32.1 | C17.1 56.81,-15.56 U19.5 v55.09,-15.56
  Bottom 0.159: v12.38,41.91 12.38,41.46 v14.47,39.37 | v10,23.18 10.48,23.65 10.48,29.53 | 10.48,29.53 10.48,35.88 | 10.48,35.88 v10.48,41.91 | v10,29.53 10.48,29.53 | v10,35.88 10.48,35.88 | 10.48,35.88 11.43,35.88 12.7,37.15 14.76,37.15 15.08,36.83 15.72,36.83 17.46,38.58 29.21,38.58 34.13,43.5 35.08,43.5 35.56,43.97 36.83,43.97 37.31,43.5 39.69,43.5 40.01,43.81 41.27,43.81 41.75,43.34 45.56,43.34 v45.72,43.18 46.67,42.23 46.67,41.27 47.31,40.64 v47.31,37.47 | v47.31,35.88 47.31,30.48 v46.99,30.16 47.31,29.84 v47.31,24.77 | v47.31,23.18 47.31,13.02 | v55.09,-15.56 55.09,-16.83 55.56,-17.3 55.56,-17.62 54.29,-18.89 v52.39,-18.89
CANH  (3 unrouted)
CANL  (3 unrouted)
DIGITALOUT_HIGHZ  (via drill 0.3)
  Top 0.159: U17.15 v22.5,24.13 U17.2 | U17.7 25.75,22.03 v25.72,22.07 | v26.35,26.04 26.41,26.09 U17.9 26.41,27.89 26.04,28.26 26.04,28.73 25.75,29.01 U18.7 25.75,30.92 v25.72,30.96 | v26.35,34.92 26.41,34.98 U18.9 | U18.2 v22.5,33.02 U18.15
  Bottom 0.159: v25.72,22.07 25.72,24.13 | 25.72,24.13 25.88,24.29 25.88,25.56 v26.35,26.04 | 25.72,24.13 v22.5,24.13 | v25.72,30.96 25.72,33.02 | 25.72,33.02 25.88,33.18 25.88,34.45 v26.35,34.92 | 25.72,33.02 v22.5,33.02
GFIV
  Top 0.159: J1.16 22.74,10.16 13.97,10.16 12.54,8.73 10.16,8.73 6.03,12.86 R42.1
GFIV_LV  (via drill 0.3)
  Top 0.159: R42.2 2.67,12.29 v2.54,12.06 | v2.54,12.06 C40.1 | R44.1 v2.54,12.06 | v2.54,12.06 R43.2
  Bottom 0.159: v2.54,12.06 0.64,13.97 0.64,46.83 2.7,48.9 2.7,50.16 0.64,52.23 0.64,54.45 8.89,62.71 U20.21
GIV
  Top 0.159: J1.3 32,15.49 32.38,15.88 32.38,33.02 TP3.1 R10.1
  Bottom 0.159: J1.2 J1.3
GIVT  (via drill 0.3)
  Top 0.159: v23.5,15.4 21.91,15.4 19.84,17.46 18.41,17.46 17.46,18.41 17.46,30.16 16.51,31.11 R28.1
  Bottom 0.159: J1.6 23.72,15.4 v23.5,15.4
GIW
  Top 0.159: J1.12 J1.13 30.86,15.47 31.75,16.35 31.75,38.73 TP4.1 R14.1
GND  (via drill 0.3, 0.5)  (44 unrouted)
  other vias: 39.37,8.89 32.07,12.38 31.43,15.24 33.81,15.4 32.54,15.24 30.32,15.24 27.3,16.51 26.51,23.5 26.51,24.77 40.64,21.91 40.64,28.26 40.64,34.61 40.64,40.96 44.45,35.4 44.45,41.75 44.45,29.05 44.45,22.7 40.64,20.64 40.64,26.99 40.64,33.34 40.64,39.69 36.2,33.81 36.2,27.46 36.2,21.11 36.2,40.16 46.67,21.27 46.67,27.46 46.67,33.81 46.67,40.16 38.73,22.86 38.73,29.21 38.73,35.56 38.73,41.91 25.24,28.57 25.08,32.38 26.35,32.38 25.08,23.5 25.24,24.92 25.24,33.81 26.51,33.66 23.18,32.38 23.18,33.66 21.91,33.66 21.91,32.38 21.91,24.77 23.18,24.77 23.18,23.5 21.91,23.5 29.53,30 29.84,31.27 29.21,28.73 28.26,23.97 27.15,21.75 27.15,30.64 39.85,25.08 39.85,18.73 39.85,31.43 39.85,37.78 48.1,38.1 42.7,40.01 42.55,38.58 42.55,33.5 42.55,32.23 42.55,27.15 42.55,25.88 42.55,19.53 42.55,20.8 33.66,22.38 33.02,28.1 32.38,33.81 36.2,38.73 37.47,37.94 36.2,32.38 37.47,31.59 37.47,25.24 36.2,26.04 37.47,18.89 36.2,19.68 34.29,21.27 33.66,26.99 33.02,32.7 32.38,38.42 31.59,39.69 31.11,31.11 31.11,21.59 53.66,28.42 52.39,33.66 51.12,38.42 51.12,35.08 55.56,36.2 55.56,37.47 52.39,30 53.18,24.45 50.64,21.91 55.56,24.77 52.7,21.27 23.18,12.54 25.72,12.7 18.1,12.06 15.08,10.79 27.94,76.99 21.59,77.31 28.89,76.68 23.5,76.99 19.68,73.03 19.84,77.63 23.5,77.79 28.89,67.79 32.07,67.79 32.07,70.33 28.89,70.33 29.69,69.53 31.27,69.53 29.69,68.58 31.27,68.58 30.48,69.06 51.59,66.83 55.56,67.94 54.13,72.87 46.99,70.17 45.72,70.17 48.26,70.17 35.24,71.75 37.15,73.66 34.29,72.71 40.96,74.93 42.86,73.66 43.5,70.96 42.39,70.96 45.09,73.66 47.62,73.66 47.62,74.93 37.94,76.99 44.93,77.15 46.51,78.11 50.16,74.3 55.24,74.3 55.56,77.95 59.05,76.68 55.72,76.83 53.18,78.11 55.88,74.14 59.05,73.34 59.05,74.14 59.05,72.55 53.34,72.55 55.56,75.56 51.44,75.41 48.9,70.96 44.13,67.15 45.09,72.39 36.35,69.06 57.94,78.9 57.31,79.53 26.67,28.57 8.26,12.06 7.62,10.32 8.41,9.05 1.59,20.32 5.4,10.32 5.4,12.22 5.4,13.49 6.99,12.86 5.4,8.89 5.87,15.4 7.3,15.72 3.49,15.24 1.59,15.24 2.54,13.65 1.59,17.46 4.76,16.67 0.79,7.14 2.54,10.48 0.48,8.89 1.59,46.51 1.59,52.7 3.02,51.28 3.02,47.78 7.62,48.26 7.62,50.8 5.08,50.8 5.08,48.26 10.16,50.8 12.7,50.8 15.24,50.8 17.78,50.8 17.78,48.26 15.24,48.26 12.7,48.26 10.16,48.26 20.32,50.8 22.86,50.8 25.4,50.8 27.94,50.8 20.32,48.26 22.86,48.26 25.4,48.26 27.94,48.26 30.48,48.26 30.48,50.8 33.02,50.8 35.56,50.8 33.02,48.26 35.56,48.26 38.1,48.26 38.1,50.8 40.64,48.26 40.64,50.8 43.18,50.8 45.72,50.8 43.18,48.26 45.72,48.26 48.26,48.26 48.26,50.8 50.8,50.8 50.8,48.26 53.34,48.26 53.34,50.8 55.88,50.8 58.42,50.8 60.96,50.8 60.96,48.26 58.42,48.26 55.88,48.26 1.91,25.24 12.38,29.53 12.38,23.18 12.38,35.88 11.43,26.35 11.43,27.62 11.43,32.7 11.43,33.97 11.43,21.27 11.43,20 9.53,27.15 9.53,25.88 9.53,28.73 8.26,25.4 5.4,26.99 8.26,19.05 9.53,19.53 9.53,20.8 9.53,22.38 5.4,20.64 13.34,19.05 13.34,25.4 13.34,31.75 15.08,29.37 15.08,35.72 15.08,23.02 5.4,33.34 8.26,31.75 11.43,40.48 11.75,39.21 9.68,39.53 8.26,38.1 5.4,39.69 15.24,37.47 11.43,36.83 57.63,67.63 58.42,70.17 65.88,67.63 66.99,70.01 62.39,70.01 62.23,67.63 44.45,1.75 34.29,0.48 27.94,0.48 22.86,0.48 17.78,0.48 43.18,0.48 59.53,-9.53 39.69,1.75 17.78,31.11 18.41,20.95 28.89,24.92 28.89,27.3 19.37,27.94 20.64,33.66 20.64,32.38 15.24,9.21 24.92,10.32 23.81,10 29.05,10.16 28.1,10.16 14.76,12.54 19.05,18.26 19.53,16.03 16.67,14.13 18.1,10.79 21.91,16.19 23.65,16.19 20.64,17.62 23.18,19.37 21.27,19.37 19.68,19.53 19.84,21.59 27.62,19.53 24.45,19.37 16.99,16.51 14.76,14.29 13.65,14.92 16.19,17.78 16.51,19.05 18.41,19.21 16.51,23.97 16.83,25.24 16.83,29.84 16.51,31.75 15.56,40.48 15.4,41.91 20,24.13 17.46,1.75 17.14,3.33 15.88,3.33 15.88,4.92 17.46,4.92 13.81,4.92 13.81,3.33 13.81,8.57 17.62,9.21 13.49,12.86 39.69,3.33 41.59,3.33 41.59,1.75 20.64,37.15 21.91,37.94 27.15,35.4 28.26,34.45 9.68,41.43 9.68,37.31 9.68,35.08 9.68,32.23 9.68,33.66 13.34,33.02 9.84,24.13 11.11,24.13 9.84,30.32 11.11,30.48 5.08,35.24 5.08,41.59 5.87,22.7 5.08,28.89 3.65,34.29 3.65,27.94 3.65,40.64 16.51,36.83 17.78,37.94 16.51,38.58 17.78,39.21 21.27,39.21 3.49,43.81 5.08,43.18 5.08,36.83 5.08,30.48 5.08,24.13 3.49,22.86 3.49,24.13 3.49,29.21 3.49,30.48 3.49,35.56 3.49,36.83 1.59,44.61 4.76,44.61 5.71,46.35 6.99,46.99 3.17,46.2 6.51,44.29 48.26,27.3 48.26,22.38 48.1,23.97 46.51,37.47 47.94,36.83 47.94,40.01 46.67,19.05 48.26,19.05 48.26,20.95 46.67,25.4 46.67,31.75 48.9,31.75 48.58,33.66 48.26,25.4 34.29,44.13 54.29,-16.51 51.12,-16.03 55.72,-16.51 52.86,-18.26 54.29,-18.1 55.72,-18.26 53.34,-9.05 53.34,-6.83 46.2,62.07 40.64,43.02 38.58,44.13 36.2,43.34 42.55,44.13 33.34,41.91 31.59,41.75 28.89,39.21 29.37,37.94 25.4,37.94 24.92,39.21 9.21,46.99 19.05,46.67 21.27,46.2 17.78,44.61 16.03,46.35 33.5,45.4 36.04,45.72 38.26,46.04 40.16,46.67 42.39,46.99 44.61,47.31 53.66,45.09 55.56,45.88 61.59,51.75 66.99,54.45 56.2,63.98 54.13,63.66 52.7,63.34 50.48,63.02 48.26,62.71 44.13,61.75 41.91,61.44 39.69,61.12 37.47,60.8 35.24,60.48 33.02,60.17 34.29,58.9 40.64,58.9 46.99,58.9 54.45,58.9 57.78,63.66 60.01,61.28 63.82,57.47 58.1,55.4 21.27,42.55 17.78,41.91 36.04,16.67 37.47,16.67
  pour Bottom (isolate 0.159, rank 4): -1.27,-1.27 -1.27,81.28 93.98,81.28 93.98,-1.27
  pour Top (isolate 0.159, rank 4): -2.54,-2.54 95.25,-2.54 95.25,82.55 -2.54,82.55
MFIV
  Top 0.159: J1.17 20.45,12.7 16.03,12.7 12.38,9.05 10.32,9.05 7.62,11.75 7.62,14.61 6.19,16.03 R39.1
MFIV_LV  (via drill 0.3)
  Top 0.159: R41.1 v2.54,15.24 | v2.54,15.24 R40.2 | R39.2 v2.54,15.24 | v2.54,15.24 C35.1
  Bottom 0.159: v2.54,15.24 0.95,16.83 0.95,46.67 2.7,48.42 4.29,48.42 4.92,49.05 4.92,50.01 4.29,50.64 2.7,50.64 0.95,52.39 0.95,54.29 U20.20
MIV
  Top 0.159: J1.21 J1.20 34.3,12.05 33.15,13.21 33.15,15.75 33.02,15.88 33.02,27.3 TP1.1 R2.1
MIVT
  Top 0.159: J1.7 19.68,17.14 18.26,17.14 17.14,18.26 17.14,24.13 16.51,24.77 R24.1
MIW
  Top 0.159: J1.19 J1.11 35.44,15.05 34.92,15.56 34.45,15.56 33.66,16.35 33.66,21.59 TP2.1 R6.1
N$2  (1 unrouted)
N$9
  Top 0.159: C45.2 R49.1
OVH
  Top 0.159: J1.26 19.64,9.84 14.13,9.84 12.7,8.41 10,8.41 8.73,9.68 R45.1
OVH_LV  (via drill 0.3)
  Top 0.159: R47.1 v2.54,8.89 | v2.54,8.89 R46.2 | R45.2 v2.54,8.89 | v2.54,8.89 C41.1
  Bottom 0.159: v2.54,8.89 0.32,11.11 0.32,46.99 2.38,49.05 2.38,50.01 0.32,52.07 0.32,54.61 6.35,60.64 U20.22
PIO_01
  Top 0.159: C43.1 U20.1
PIO_23
  Top 0.159: C44.1 U20.23
PIO_48
  Top 0.159: C42.1 U20.48
Q1_BASE  (2 unrouted)
Q1_EMITTER  (1 unrouted)
Q2_BC  (2 unrouted)
Q3_BASE  (2 unrouted)
Q3_EMITTER  (1 unrouted)
Q4_BC  (2 unrouted)
Q5_BASE  (2 unrouted)
Q5_EMITTER  (1 unrouted)
Q6_BC  (2 unrouted)
Q7_BASE  (2 unrouted)
Q7_EMITTER  (1 unrouted)
Q8_BC  (2 unrouted)
RD_A  (1 unrouted)
RD_A_LV  (1 unrouted)
  Top 0.159: 63.82,52.86 55.56,61.12 43.02,61.12 U20.9
RD_B  (1 unrouted)
RD_B_LV  (1 unrouted)
  Top 0.159: 63.5,52.7 55.4,60.8 40.8,60.8 U20.10
RD_CLKIN  (2 unrouted)
RD_COS  (1 unrouted)
RD_COSLO  (1 unrouted)
RD_DIR  (1 unrouted)
RD_DIR_LV  (1 unrouted)
  Top 0.159: 62.87,52.39 55.09,60.17 36.35,60.17 U20.12
RD_EXC  (1 unrouted)
RD_EXCOUT  (5 unrouted)
RD_MT1  (via drill 0.3)  (1 unrouted)
  Top 0.159: R31.2 14.47,41.27 R37.2 15.85,41.14 17.14,39.85 17.14,30.96 17.78,30.32 17.78,18.89 v18.26,18.41 | v16.83,17.3 14.13,14.61 v14.13,11.59 | v14.45,9.05 14.45,3.17 v16.51,1.11
  Bottom 0.159: v16.83,17.3 17.94,18.41 v18.26,18.41 | v14.13,11.59 14.13,9.37 v14.45,9.05 | v16.51,1.11 46.35,1.11
RD_MT2  (1 unrouted)
RD_NM  (1 unrouted)
RD_NM_LV  (1 unrouted)
  Top 0.159: 63.18,52.55 55.24,60.48 38.58,60.48 U20.11
RD_REFBYP  (1 unrouted)
RD_SCLK  (1 unrouted)
RD_SCLK_LV  (1 unrouted)
  Top 0.159: 65.09,53.5 56.2,62.39 49.37,62.39 U20.6
RD_SIN  (1 unrouted)
RD_SINLO  (1 unrouted)
RD_SO  (1 unrouted)
RD_SO_LV  (1 unrouted)
  Top 0.159: 64.14,53.02 55.72,61.44 45.24,61.44 U20.8
RD_XTALOUT  (2 unrouted)
U5_IN+
  Top 0.159: R4.1 R2.2 39.16,29.84 U5.3
U5_IN-
  Top 0.159: R3.1 36.97,26.85 37.15,26.67 37.78,26.67 37.97,26.49 | 37.97,26.49 R1.2 | 37.97,26.49 38.15,26.67 39.59,26.67 U5.4
U5_OUT
  Top 0.159: R3.2 38.89,27.3 39.21,27.62 40.8,27.62 41.59,28.41 | 41.59,28.41 U5.1 | 41.59,28.41 42.06,27.94 43.4,27.94 U1.3
U6_IN+
  Top 0.159: R8.1 37.97,22.86 R6.2 39.16,23.5 U6.3
U6_IN-
  Top 0.159: R5.2 37.97,20.14 | 37.97,20.14 37.78,20.32 37.15,20.32 36.97,20.5 R7.1 | 37.97,20.14 38.15,20.32 39.59,20.32 U6.4
U6_OUT
  Top 0.159: R7.2 38.89,20.95 39.21,21.27 40.8,21.27 41.51,21.99 41.59,22.06 | 41.59,22.06 U6.1 | 41.59,22.06 42.06,21.59 43.4,21.59 U2.3
U7_IN+
  Top 0.159: R12.1 R10.2 39.16,36.2 U7.3
U7_IN-
  Top 0.159: R11.1 36.97,33.2 37.15,33.02 37.78,33.02 37.97,32.84 | 37.97,32.84 R9.2 | 37.97,32.84 38.15,33.02 39.59,33.02 U7.4
U7_OUT
  Top 0.159: R11.2 38.89,33.66 39.21,33.97 40.8,33.97 41.59,34.76 | 41.59,34.76 U7.1 | 41.59,34.76 42.06,34.29 43.4,34.29 U3.3
U8_IN+
  Top 0.159: U8.3 39.16,42.55 R14.2 R15.1
U8_IN-
  Top 0.159: R16.1 36.97,39.55 37.15,39.37 37.78,39.37 37.94,39.21 37.97,39.19 | 37.97,39.19 R13.2 | 37.97,39.19 38.15,39.37 39.59,39.37 U8.4
U8_OUT
  Top 0.159: R16.2 38.89,40.01 39.21,40.32 40.8,40.32 41.59,41.11 | 41.59,41.11 U8.1 | 41.59,41.11 42.06,40.64 43.4,40.64 U4.3
U13_IN+
  Top 0.159: U13.3 12.91,18.41 R20.2 R22.1
U13_IN-
  Top 0.159: R21.1 15.11,21.41 14.92,21.59 14.29,21.59 14.11,21.77 | 14.11,21.77 R19.2 | 14.11,21.77 13.92,21.59 12.48,21.59 U13.4
U13_OUT
  Top 0.159: R21.2 13.18,20.95 12.86,20.64 11.27,20.64 10.48,19.84 | 10.48,19.84 U13.1 | 10.48,19.84 10.11,20.21 U9.3
U14_IN+
  Top 0.159: U14.3 12.91,24.77 R24.2 R26.1
U14_IN-
  Top 0.159: R25.1 15.11,27.76 14.92,27.94 14.29,27.94 14.11,28.12 | 14.11,28.12 R23.2 | 14.11,28.12 13.92,27.94 12.48,27.94 U14.4
U14_OUT
  Top 0.159: R25.2 13.18,27.3 12.86,26.99 11.27,26.99 10.48,26.19 | 10.48,26.19 U14.1 | 10.48,26.19 10.11,26.57 U10.3
U15_IN+
  Top 0.159: R30.1 R28.2 12.91,31.11 U15.3
U15_IN-
  Top 0.159: R29.1 15.11,34.11 14.92,34.29 14.29,34.29 14.11,34.47 | 14.11,34.47 R27.2 | 14.11,34.47 13.92,34.29 12.48,34.29 U15.4
U15_OUT
  Top 0.159: R29.2 13.18,33.66 12.86,33.34 11.27,33.34 10.48,32.54 | 10.48,32.54 U15.1 | 10.48,32.54 10.11,32.91 U11.3
U16_IN+
  Top 0.159: U16.3 12.91,37.47 R36.1 R35.2
U16_IN-
  Top 0.159: U16.4 12.78,41.14 R33.1 13.49,42.36 R31.1
U16_OUT
  Top 0.159: U12.3 9.84,37.99 U16.1 | U16.1 | R33.2 13.04,39.69 12.06,39.69 11.91,39.85 11.59,39.85 10.48,38.73 U16.1
U24_IN+  (2 unrouted)
U24_IN-  (3 unrouted)
U24_OUT  (2 unrouted)
U25_IN+  (2 unrouted)
U25_IN-  (3 unrouted)
U25_OUT  (2 unrouted)
VH  (via drill 0.3)
  Top 0.159: v21.91,12.86 21.73,13.04 21.73,14.63 19.53,16.83 18.1,16.83 16.51,18.41 R20.1
  Bottom 0.159: J1.25 22.88,11.89 v21.91,12.86
VIN
  Top 0.159: VR2.2 27.4,79.69 44.63,79.69 R50.1
  pour Top (rank 2): 11.43,72.39 23.18,72.39 24.13,73.34 24.13,78.74 24.29,78.9 26.99,78.9 27.15,78.74 27.15,70.96 25.4,69.22 10.79,69.22 9.84,70.17 9.84,71.44 10.79,72.39
VIN_BYP_MID
  pour Top (isolate 0.159, no thermals): 20.16,73.5 20.16,76.52 23.02,76.52 23.02,73.5
VR2_EN
  Top 0.159: R50.2 45.63,77.69 VR2.1
VR2_TRIM
  Top 0.159: R48.1 R49.2 36.83,74.3 34.54,72.01 VR2.4
VR3_FB
  Top 0.159: VR3.4 53.5,68.24 R51.1
VR3_FS
  Top 0.159: VR3.13 R52.1

## Text on the board
bPlace: 9V-34V | CMOD-35T Inverter controller board / Jackson Gray / jackmaxg@mit.edu